# Altium schematic sheet DAUGHTER_BOARD.SchDoc
size A4; SheetNumber: 2; SheetTotal: 2
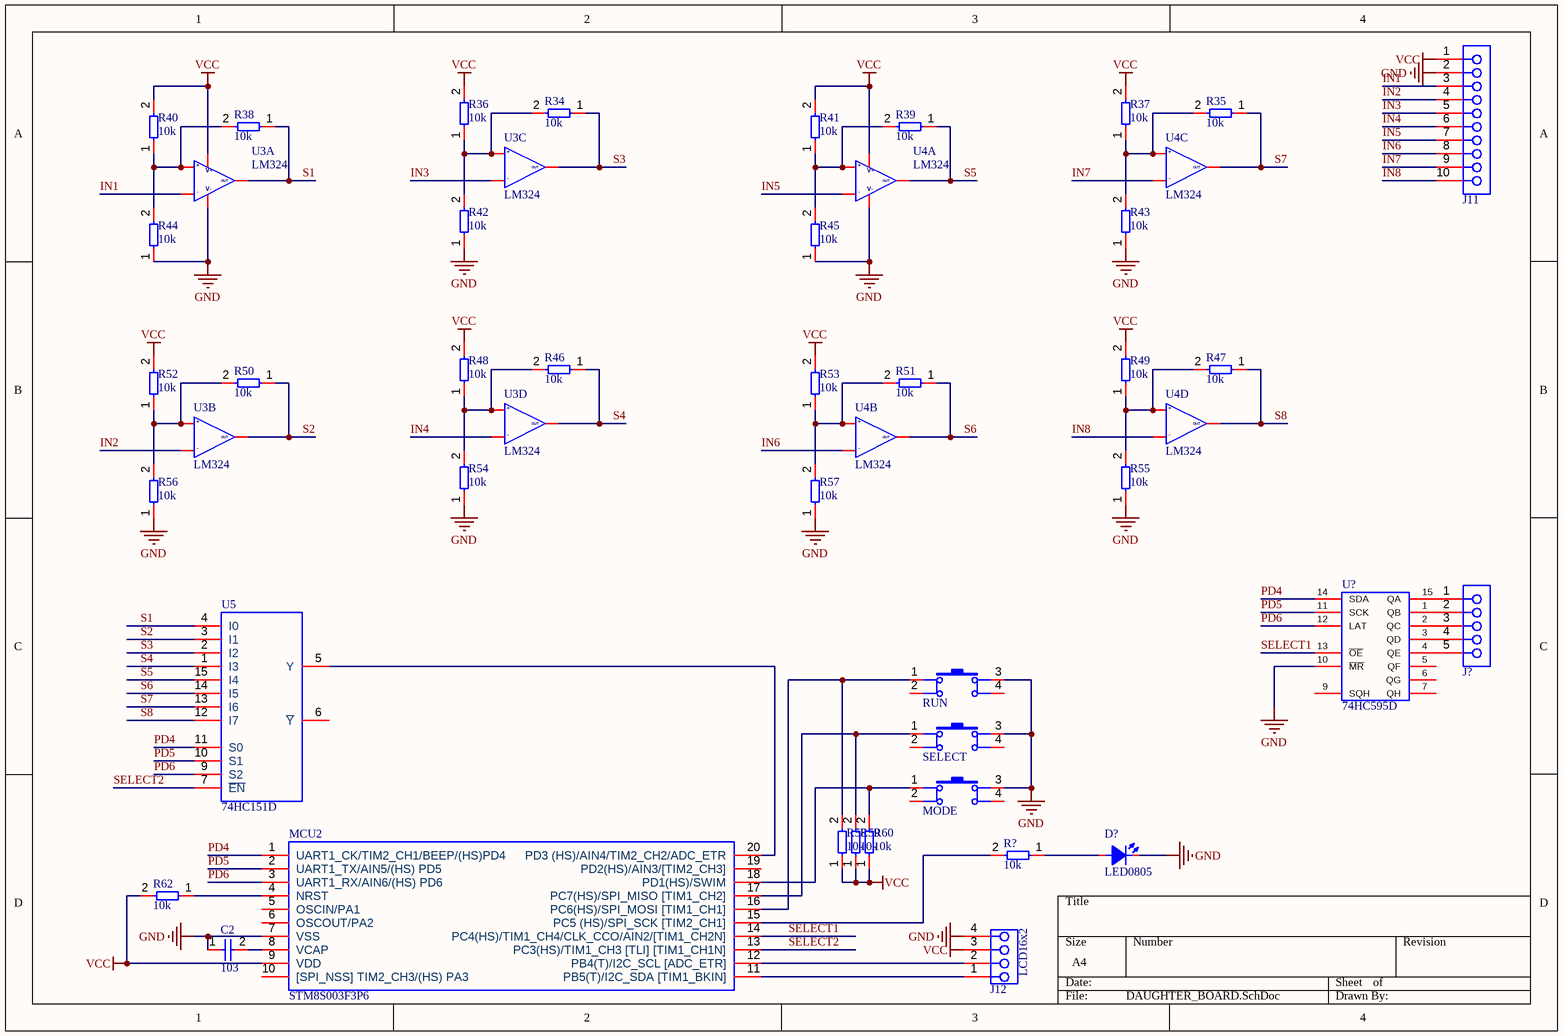
[diagram p0: DAUGHTER_BOARD.SchDoc]

## Parts
C2  103  [C0805]
D?  LED0805  [L0805RED]
J11  Header 10x1 TH Pitch 2.54mm  [Header 10x1 TH Pitch 2.54mm]  (value not drawn)
J12  LCD16x2  [JST - XH - Thru (R) - 4Pin - 2.54mm]
J?  Header 5x1 TH Pitch 2.54mm  [Header 5x1 TH Pitch 2.54mm]  (value not drawn)
MCU2  STM8S003F3P6  [TSSOP20_0.65_4.4]
MODE  Button Hole  [BUTTON_HOLE_4.3mm]  (value not drawn)
R34  10k  [R0805]
R35  10k  [R0805]
R36  10k  [R0805]
R37  10k  [R0805]
R38  10k  [R0805]
R39  10k  [R0805]
R40  10k  [R0805]
R41  10k  [R0805]
R42  10k  [R0805]
R43  10k  [R0805]
R44  10k  [R0805]
R45  10k  [R0805]
R46  10k  [R0805]
R47  10k  [R0805]
R48  10k  [R0805]
R49  10k  [R0805]
R50  10k  [R0805]
R51  10k  [R0805]
R52  10k  [R0805]
R53  10k  [R0805]
R54  10k  [R0805]
R55  10k  [R0805]
R56  10k  [R0805]
R57  10k  [R0805]
R58  10k  [R0805]
R59  10k  [R0805]
R60  10k  [R0805]
R62  10k  [R0805]
R?  10k  [R0805]
RUN  Button Hole  [BUTTON_HOLE_4.3mm]  (value not drawn)
SELECT  Button Hole  [BUTTON_HOLE_4.3mm]  (value not drawn)
U3  LM324  [SOP-14]  (parts A,B,C,D of 4)
U4  LM324  [SOP-14]  (parts A,B,C,D of 4)
U5  74HC151D  [SO16]
U?  74HC595D  [SO16]

## Nets
GND: C2.1 D?.2(K) J11.2 J12.4 MCU2.7(VSS) MODE.3 R42.1 R43.1 R44.1 R45.1 R54.1 R55.1 R56.1 R57.1 RUN.3 SELECT.3 U3.11 U4.11 U5.8 U?.8 U?.10(~{MR})
VCC: J11.1 J12.3 MCU2.9(VDD) R36.2 R37.2 R40.2 R41.2 R48.2 R49.2 R52.2 R53.2 R58.1 R59.1 R60.1 R62.2 U3.4 U4.4 U5.16 U?.16
IN1: J11.3 U3.2(-)
IN2: J11.4 U3.6(-)
IN3: J11.5 U3.9(-)
IN4: J11.6 U3.13(-)
IN5: J11.7 U4.2(-)
IN6: J11.8 U4.6(-)
IN7: J11.9 U4.9(-)
IN8: J11.10 U4.13(-)
PD4: MCU2.1(UART1_CK/TIM2_CH1/BEEP/(HS)PD4) U5.11(S0) U?.14(SDA)
PD5: MCU2.2(UART1_TX/AIN5/(HS)_PD5) U5.10(S1) U?.11(SCK)
PD6: MCU2.3(UART1_RX/AIN6/(HS)_PD6) U5.9(S2) U?.12(LAT)
S1: R38.1 U3.1(OUT) U5.4(I0)
S2: R50.1 U3.7(OUT) U5.3(I1)
S3: R34.1 U3.8(OUT) U5.2(I2)
S4: R46.1 U3.14(OUT) U5.1(I3)
S5: R39.1 U4.1(OUT) U5.15(I4)
S6: R51.1 U4.7(OUT) U5.14(I5)
S7: R35.1 U4.8(OUT) U5.13(I6)
S8: R47.1 U4.14(OUT) U5.12(I7)
SELECT1: MCU2.14(PC4(HS)/TIM1_CH4/CLK_CCO/AIN2/[TIM1_CH2N]) U?.13(~{OE})
SELECT2: MCU2.13(PC3(HS)/TIM1_CH3_[TLI]_[TIM1_CH1N]) U5.7(~{EN})
NetC2_2: C2.2 MCU2.8(VCAP)
NetD?_1: D?.1(A) R?.1
NetJ12_1: J12.1 MCU2.11(PB5(T)/I2C_SDA_[TIM1_BKIN])
NetJ12_2: J12.2 MCU2.12(PB4(T)/I2C_SCL_[ADC_ETR])
NetJ?_1: J?.1 U?.15(QA)
NetJ?_2: J?.2 U?.1(QB)
NetJ?_3: J?.3 U?.2(QC)
NetJ?_4: J?.4 U?.3(QD)
NetJ?_5: J?.5 U?.4(QE)
NetMCU2_4: MCU2.4(NRST) R62.1
NetMCU2_15: MCU2.15(PC5_(HS)/SPI_SCK_[TIM2_CH1]) R?.2
NetMCU2_16: MCU2.16(PC6(HS)/SPI_MOSI_[TIM1_CH1]) R58.2 RUN.1
NetMCU2_17: MCU2.17(PC7(HS)/SPI_MISO_[TIM1_CH2]) R59.2 SELECT.1
NetMCU2_18: MCU2.18(PD1(HS)/SWIM) MODE.1 R60.2
NetMCU2_20: MCU2.20(PD3_(HS)/AIN4/TIM2_CH2/ADC_ETR) U5.5(Y)
NetR34_2: R34.2 R36.1 R42.2 U3.10(+)
NetR35_2: R35.2 R37.1 R43.2 U4.10(+)
NetR38_2: R38.2 R40.1 R44.2 U3.3(+)
NetR39_2: R39.2 R41.1 R45.2 U4.3(+)
NetR46_2: R46.2 R48.1 R54.2 U3.12(+)
NetR47_2: R47.2 R49.1 R55.2 U4.12(+)
NetR50_2: R50.2 R52.1 R56.2 U3.5
NetR51_2: R51.2 R53.1 R57.2 U4.5

Not connected (* = marked no-connect by the designer): MCU2 5(OSCIN/PA1) 6(OSCOUT/PA2) 10([SPI_NSS]_TIM2_CH3/(HS)_PA3) 19(PD2(HS)/AIN3/[TIM2_CH3]); MODE 2 4; RUN 2 4; SELECT 2 4; U5 6(~{Y}); U? 5(QF) 6(QG) 7(QH) 9(SQH)

## Notes on the sheet
- (in symbol LM324, part A) V+; V-

## Library data of the parts
C2 = C0805
J12 = JST - XH - Thru (R) - 4Pin - 2.54mm
R34-R60 R62 R? = Resistor SMD
U3 U4 = LM324: Quad-Operational Amp